# Altium schematic sheet DM.SchDoc
size A4
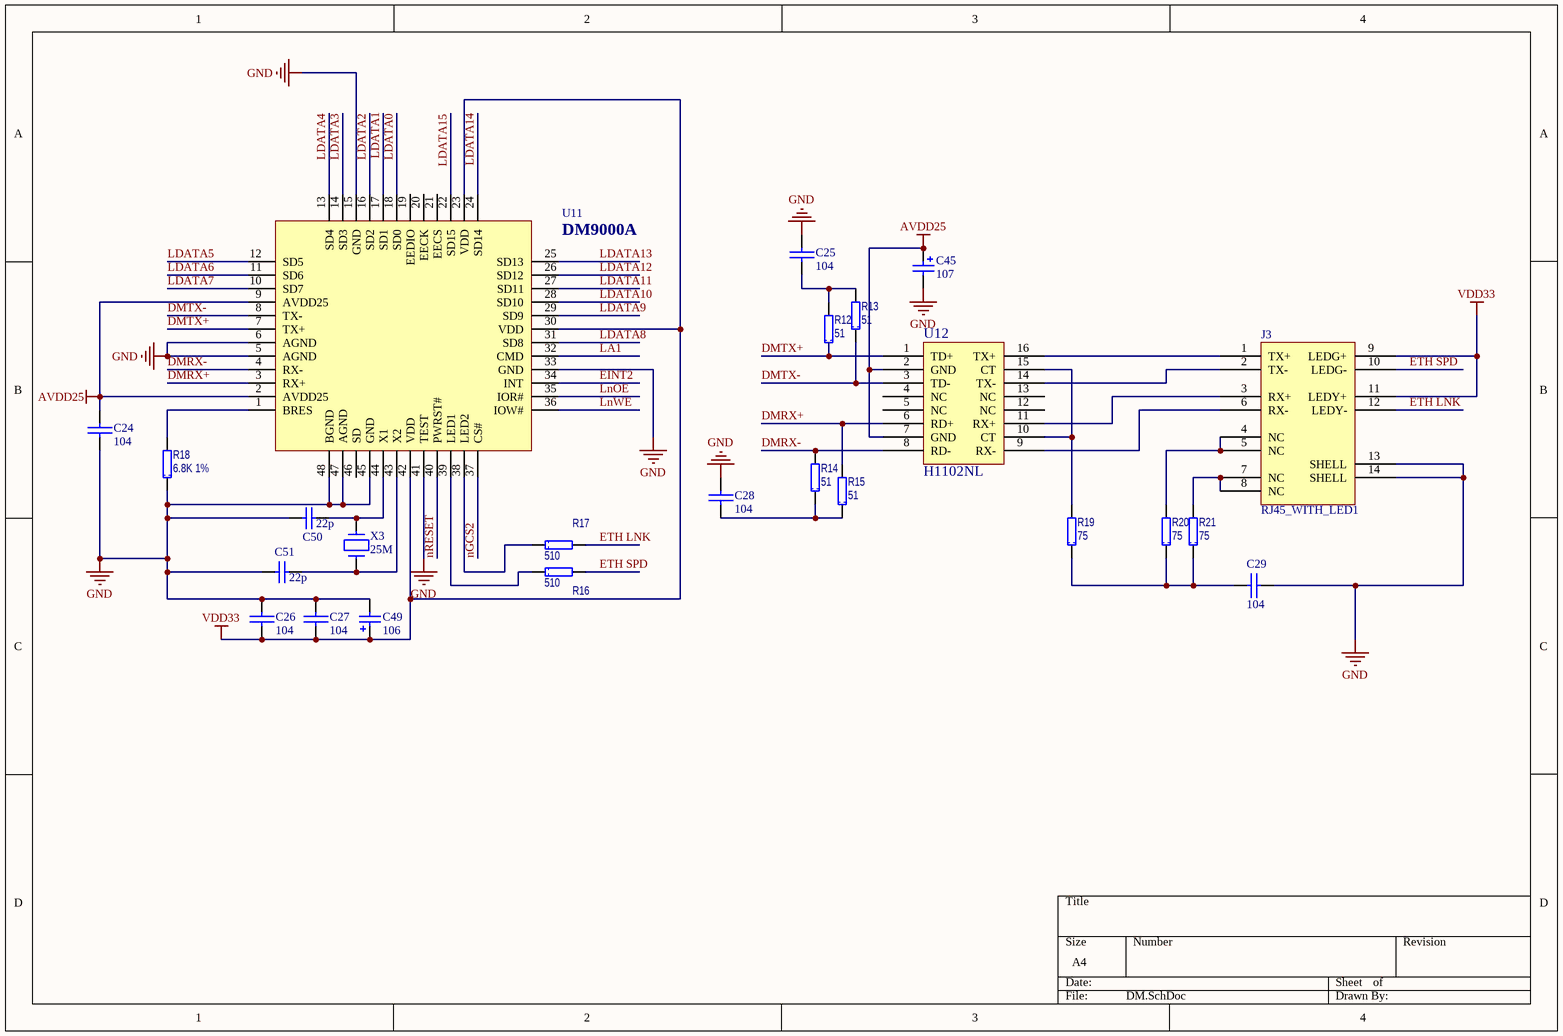
[diagram p0: DM.SchDoc]

## Parts
C24  104  [0603A]
C25  104  [0603A]
C26  104  [A型钽电容]
C27  104  [A型钽电容]
C28  104  [0603A]
C29  104  [A型钽电容]
C45  value 107  [POLAR0.8]  (hidden comment: Cap Pol2)
C49  value 106  [POLAR0.8]  (hidden comment: Cap Pol2)
C50  value 22p  [3225]  (hidden comment: Cap)
C51  value 22p  [3225]  (hidden comment: Cap)
J3  RJ45_WITH_LED1  [RJ45]
R12  51  [0603R]
R13  51  [0603R]
R14  51  [0603R]
R15  51  [0603R]
R16  510  [0603R]
R17  510  [0603R]
R18  6.8K 1%  [0603R]
R19  75  [0603R]
R20  75  [0603R]
R21  75  [0603R]
U11  DM9000A  [LQFP-48_M]
U12  H1102NL  [H1102]
X3  25M  [OSC2PR-1]

## Nets
AVDD25: C24.1 C45.1 U11.2(AVDD25) U11.9(AVDD25) U12.2(GND) U12.7(GND)
GND: C24.2 C25.1 C26.1 C27.1 C28.1 C29.2 C45.2 C49.2 C50.1 C51.1 J3.13(SHELL) J3.14(SHELL) R18.1 U11.5(AGND) U11.6(AGND) U11.15(GND) U11.33(GND) U11.41(TEST) U11.45(GND) U11.47(AGND) U11.48(BGND)
VDD33: C26.2 C27.2 C49.1 J3.9(LEDG+) J3.11(LEDY+) U11.23(VDD) U11.30(VDD) U11.42(VDD)
DMRX+: R15.2 U11.3(RX+) U12.6(RD+)
DMRX-: R14.2 U11.4(RX-) U12.8(RD-)
DMTX+: R12.1 U11.7(TX+) U12.1(TD+)
DMTX-: R13.1 U11.8(TX-) U12.3(TD-)
EINT2: U11.34(INT)
ETH LNK: J3.12(LEDY-) R17.2
ETH SPD: J3.10(LEDG-) R16.2
LA1: U11.32(CMD)
LDATA0: U11.18(SD0)
LDATA1: U11.17(SD1)
LDATA2: U11.16(SD2)
LDATA3: U11.14(SD3)
LDATA4: U11.13(SD4)
LDATA5: U11.12(SD5)
LDATA6: U11.11(SD6)
LDATA7: U11.10(SD7)
LDATA8: U11.31(SD8)
LDATA9: U11.29(SD9)
LDATA10: U11.28(SD10)
LDATA11: U11.27(SD11)
LDATA12: U11.26(SD12)
LDATA13: U11.25(SD13)
LDATA14: U11.24(SD14)
LDATA15: U11.22(SD15)
LnOE: U11.35(IOR#)
LnWE: U11.36(IOW#)
nGCS2: U11.37(CS#)
nRESET: U11.40(PWRST#)
NetC25_2: C25.2 R12.2 R13.2
NetC28_2: C28.2 R14.1 R15.1
NetC29_1: C29.1 R19.1 R20.1 R21.1
NetC50_2: C50.2 U11.44(X1) X3.2
NetC51_2: C51.2 U11.43(X2) X3.1
NetJ3_1: J3.1(TX+) U12.16(TX+)
NetJ3_2: J3.2(TX-) U12.14(TX-)
NetJ3_3: J3.3(RX+) U12.11(RX+)
NetJ3_4: J3.4(NC) J3.5(NC) R20.2
NetJ3_6: J3.6(RX-) U12.9(RX-)
NetJ3_7: J3.7(NC) J3.8(NC) R21.2
NetR16_1: R16.1 U11.39(LED1)
NetR17_1: R17.1 U11.38(LED2)
NetR18_2: R18.2 U11.1(BRES)
NetR19_2: R19.2 U12.10(CT) U12.15(CT)

Not connected (* = marked no-connect by the designer): U11 19(EEDIO) 20(EECK) 21(EECS) 46(SD); U12 4(NC) 5(NC) 12(NC) 13(NC)

## Library data of the parts
C24 = CAP_3
C25 C28 = CAP_2: Capacitor
C26 C27 C29 = CAP_1: Capacitor
C45 C49 = Cap Pol2: Polarized Capacitor (Axial); Published: 8-Jun-2000; LatestRevisionDate: 17-Jul-2002; LatestRevisionNote: Re-released for DXP Platform.; PackageReference: POLAR0.8; Publisher: Altium Limited; PackageDescription: Polarized Capacitor; 2 Leads
C50 C51 = Cap: Capacitor; Published: 8-Jun-2000; LatestRevisionDate: 17-Jul-2002; LatestRevisionNote: Re-released for DXP Platform.; PackageReference: RAD-0.3; Publisher: Altium Limited
R12-R21 = RES
U11 = DM9000A: 网络芯片
U12 = H1012
X3 = CRYSTAL_2